# Altium project MC_Isolation_PCB.PrjPcb
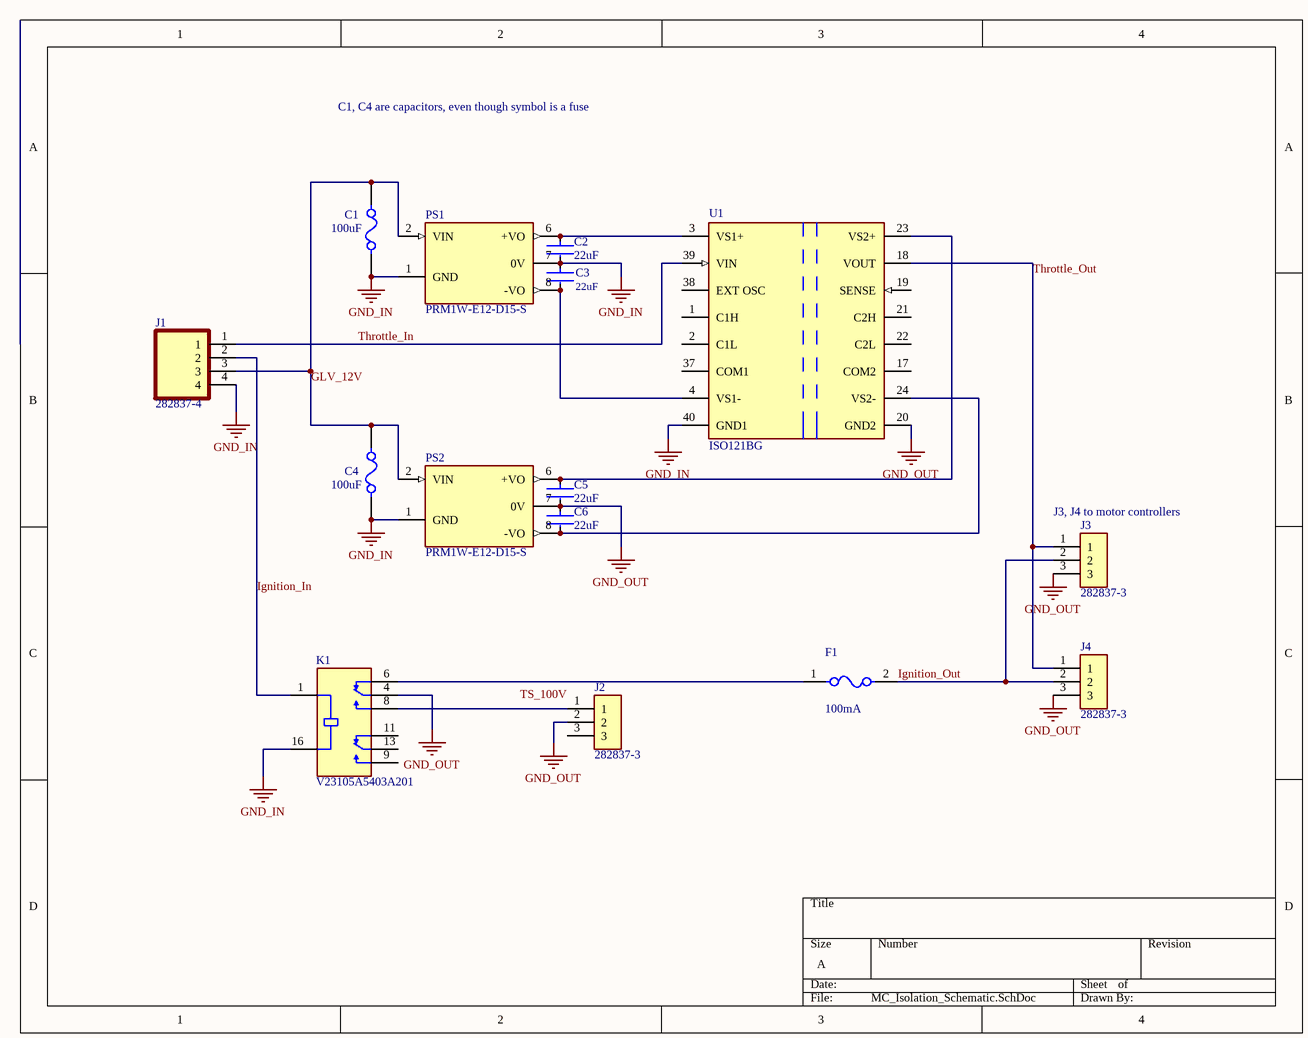
[diagram p0: MC_Isolation_Schematic.SchDoc]
1 sheet, 15 parts. Net scope: global (net labels, ports and power ports of the same name join across sheets).
Board file: MC_Isolation_PCB.PcbDoc

## Sheet MC_Isolation_Schematic.SchDoc
size A; SheetNumber: 1; SheetTotal: 1

### Parts
C1  100uF  [FP-MF-R050-MFG]
C2  22uF  [FP-C3216-160-0_2-IPC_B]
C3  22uF  [FP-C3216-160-0_2-IPC_B]
C4  100uF  [FP-MF-R050-MFG]
C5  22uF  [FP-C3216-160-0_2-IPC_B]
C6  22uF  [FP-C3216-160-0_2-IPC_B]
F1  100mA  [FP-0154-MFG]
J1  282837-4  [TE_282837-4]
J2  282837-3  [TE_282837-3]
J3  282837-3  [TE_282837-3]
J4  282837-3  [TE_282837-3]
K1  V23105A5403A201  [RELAY_1393793-8]
PS1  PRM1W-E12-D15-S  [CONV_PRM1W-E12-D15-S]
PS2  PRM1W-E12-D15-S  [CONV_PRM1W-E12-D15-S]
U1  ISO121BG  [FP-JVD0016A-MFG]

### Nets
GND_IN: C1.1 C2.2 C3.1 C4.1 J1.4 K1.16(COIL2) PS1.1(GND) PS1.7(0V) PS2.1(GND) U1.40(GND1)
GND_OUT: C5.2 C6.1 J2.2 J3.3 J4.3 K1.4(COM1) PS2.7(0V) U1.20(GND2)
GLV_12V: C1.2 C4.2 J1.3 PS1.2(VIN) PS2.2(VIN)
Ignition_In: J1.2 K1.1(COIL1)
Ignition_Out: F1.2 J3.2 J4.2
Throttle_In: J1.1 U1.39(VIN)
Throttle_Out: J3.1 J4.1 U1.18(VOUT)
NetC2_1: C2.1 PS1.6(+VO) U1.3(VS1+)
NetC3_2: C3.2 PS1.8(-VO) U1.4(VS1-)
NetC5_1: C5.1 PS2.6(+VO) U1.23(VS2+)
NetC6_2: C6.2 PS2.8(-VO) U1.24(VS2-)
NetF1_1: F1.1 K1.6(NC1)
NetJ2_1: J2.1 K1.8(NO1)

Not connected (* = marked no-connect by the designer): J2 3; K1 9(NO2) 11(NC2) 13(COM2); U1 1(C1H) 2(C1L) 17(COM2) 19(SENSE) 21(C2H) 22(C2L) 37(COM1) 38(EXT_OSC)

### Notes on the sheet
- C1, C4 are capacitors, even though symbol is a fuse
- (near J3) J3, J4 to motor controllers
- Labels drawn without touching a wire or pin: TS_100V

### Library data of the parts
C1 C4 = CMP-07400-000037-1: PTC RESET FUSE 60V 500MA RADIAL; Manufacturer Part Number: MF-R050; Manufacturer: Bourns; Current Rating: 40A; Trip Time: 4s; Resistance: 0.41-0.77Ω; Value: 0.41-0.77Ω; Trip Current: 1A; Hold Current: 0.5A; Automotive: No; Device Class L1: Circuit Protection; Ambient Temperature Range Low: -40°C; Height: 13.7mm; Category: Fuse; ComponentLink2Description: Datasheet; Device Class L3: unset; Mouser Description: PTC Resettable Fuse 0.5A(hold) 1A(trip) 60V 40A 0.75W 4s 0.41Ohm Radial 7.9 X 3.1mm Bulk; RoHS: TRUE; Temperature Range High: +85°C; Octopart: https://octopart.com/mf-r050-bourns-19418; Temperature Range Low: -40°C; Device Class L2: PTC Resettable Fuses; Package: MF-R050; Temperature: -40°C to +85°C; Ambient Temperature Range High: +85°C; ComponentLink2URL: https://upverter.com/datasheet/a1b715b2a3574ae967878e49fe70c2811aecae4b.pdf; Digikey Description: PTC RESET FUSE 60V 500MA RADIAL; Lead Free: Yes; Voltage Rating: 60V
C2 C3 C5 C6 = CMP-2000-05402-2: Multilayer Ceramic Capacitors 1uF ±10% 50V X7R SMD 1206; Voltage: 25V; Voltage Rating (DC): 50V; Dielectric: X7R; Number of Pins: 2; Length: 0.126inch; Case Code (Imperial): 1206; Capacitance: 1uF; Package Quantity: 2000; Min Operating Temperature: -55°C; Lead Free: Lead Free; Radiation Hardening: No; Termination: SMD/SMT; Case Code (Metric): 3216; Series: C; Weight: 0.000571oz; REACH SVHC: No SVHC; Tolerance: 10%; Max Operating Temperature: 125°C; RoHS Compliant: Yes; Mount: Surface Mount; Dielectric Material: Ceramic; Packaging: Tape and Reel; Thickness: 0.071inch; Height: 1.6mm; Resistor Type: Ceramic; Width: 0.063inch; Voltage Rating: 50V; Depth: 1.6mm; Case/Package: 1206
F1 = CMP-08605-000075-1: FUSE BOARD MNT 100MA 125VAC/VDC; Manufacturer: Littelfuse Inc; Manufacturer Part Number: 0154.100DR; Fuse Current: 0.1A; Fuse I2T: 0.00138A2Sec; Resistance: 3.1Ω; Max Fuse Dc Voltage: 125V; Value: 3.1Ω; Fuse Blow Speed: Fast; Temperature Range High: +125°C; Device Class L1: Circuit Protection; RoHS: TRUE; Lead Free: Yes; ComponentLink2Description: Datasheet; Device Class L3: unset; Digikey Description: FUSE BOARD MNT 100MA 125VAC/VDC; Octopart: https://octopart.com/0154.100dr-littelfuse-557956; Temperature Range Low: -55°C; Mouser Description: Surface Mount Fuses Fuseblck w/ fuse .1A OMNI BLOK 154; Category: Fuse; Max Fuse Ac Voltage: 125V; Height: 3.81mm; Temperature: -55°C to +125°C; Voltage Rating: 125V; Package: 0154; Device Class L2: Fuses; ComponentLink2URL: https://www.littelfuse.com/~/media/electronics/datasheets/fuses/littelfuse_fuse_154_154t_154l_154tl_datasheet.pdf.pdf; Automotive: No
J1 = 282837-4: 4 Position Wire to Board Terminal Block Horizontal with Board 0.200 (5.08mm); MF: TE Connectivity; Check_prices: https://www.snapeda.com/parts/282837-4/TE%20Connectivity%20AMP%20Connectors/view-part/520354/?ref=eda; Purchase-URL: https://pricing.snapeda.com/search/part/282837-4/?ref=eda; Value: *; SnapEDA_Link: https://www.snapeda.com/parts/282837-4/TE%20Connectivity%20AMP%20Connectors/view-part/520354/?ref=snap; EU_RoHS_Compliance: Compliant with Exemptions; Package: None; Availability: Good; Price: None; MP: 282837-4
J2-J4 = 282837-3: Wire to Board 3 Position 5.08 mm Pitch 30-16 AWG Euro Style Terminal Block; MF: TE Connectivity; Check_prices: https://www.snapeda.com/parts/282837-3/TE%20Connectivity%20AMP%20Connectors/view-part/2765182/?ref=eda; SnapEDA_Link: https://www.snapeda.com/parts/282837-3/TE%20Connectivity%20AMP%20Connectors/view-part/2765182/?ref=snap; Availability: Good; MP: 282837-3; Purchase-URL: https://pricing.snapeda.com/search/part/282837-3/?ref=eda; Package: None; Price: None; Value: *
PS1 PS2 = PRM1W-E12-D15-S: 1 W, 8:1 Input Range, Single/Dual Regulated Output, 8 Pin SIP, 3000 Vdc Isolation, Dc-Dc Converter; MF: {'manufacturer': u'CUI'}; Availability: Unavailable; Package: None; MP: PRM1W-E12-D15-S; Value: *; Price: None
U1 = CMP-0998-00014-3: IC OPAMP ISOLATION 1 CIRC 16CDIP; Number of Channels: 1; Input Offset Voltage (Vos): 100mV; -3db Bandwidth: 60kHz; Input Resistance: 200kR; Voltage Gain: 0dB; Operating Supply Voltage: 18V; Min Dual Supply Voltage: 4.5V; Operating Supply Current: 4mA; Output Current per Channel: 15mA; Slew Rate: 2V/µs; Radiation Hardening: No; Number of Circuits: 1; Number of Elements: 1; Lead Free: Lead Free; RoHS Compliant: Yes; Package Quantity: 1; Min Operating Temperature: -55°C; Max Operating Temperature: 125°C; Max Dual Supply Voltage: 18V; Number of Pins: 16; Packaging: Rail/Tube
K1 = V23105A5403A201: Package: None; Price: None; Value: *; MP: V23105A5403A201; Availability: Unavailable